# Altium schematic sheet LORA.SchDoc
size 297 x 209 mm
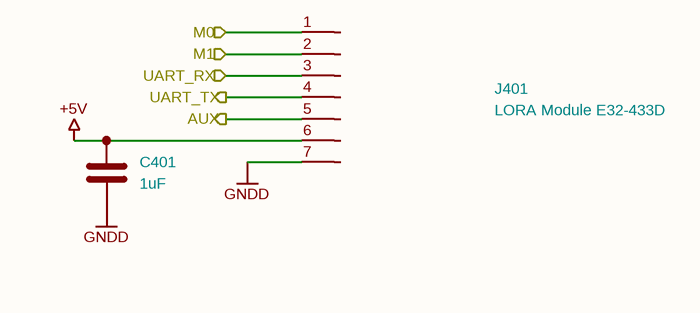
[diagram p0: LORA.SchDoc]

## Parts
C401  1uF  [C_0603_1608Metric_Pad1.08x0.95mm_HandSolder]
J401  LORA Module E32-433D  [E32-433T33D-EDITEDSIZE]

## Ports
AUX (out), M0 (in), M1 (in), UART_RX (in), UART_TX (out)

## Nets
+5V: C401.1 J401.6(Pin_6)
GNDD: C401.2 J401.7(Pin_7)
AUX: J401.5(Pin_5) ; port AUX
M0: J401.1(Pin_1) ; port M0
M1: J401.2(Pin_2) ; port M1
UART_RX: J401.3(Pin_3) ; port UART_RX
UART_TX: J401.4(Pin_4) ; port UART_TX

## Notes on the sheet
- THIS DOCUMENT AND THE DATA DISCLOSED HEREIN OR
- HEREWITH IS THE PROPERTY OF TEAM HAYA OFF ROADING AND MAY
- NOT BE FREELY DISTRIBUTED IN WHOLE. ALL RIGHTS ARE
- RESERVED AND NO EXPRESS OR IMPLIED WARANTEE IS GIVEN.

## Library data of the parts
C401 = C: Value: 1uF; Footprint: Capacitor_SMD:C_0603_1608Metric_Pad1.08x0.95mm_HandSolder
J401 = Conn_01x07_Socket: Value: LORA Module E32-433D; Footprint: LORA Modules:E32-433T33D